# Altium schematic sheet Led_7seg.SchDoc
size A4; Author: Đỗ Ngọc Quý; Organization: Altium Limited; Address1: L3, 12a Rodborough Rd; Address2: Frenchs Forest; Address3: NSW; Address4: Australia 2086; DocumentNumber: 2; SheetNumber: 2; SheetTotal: 2
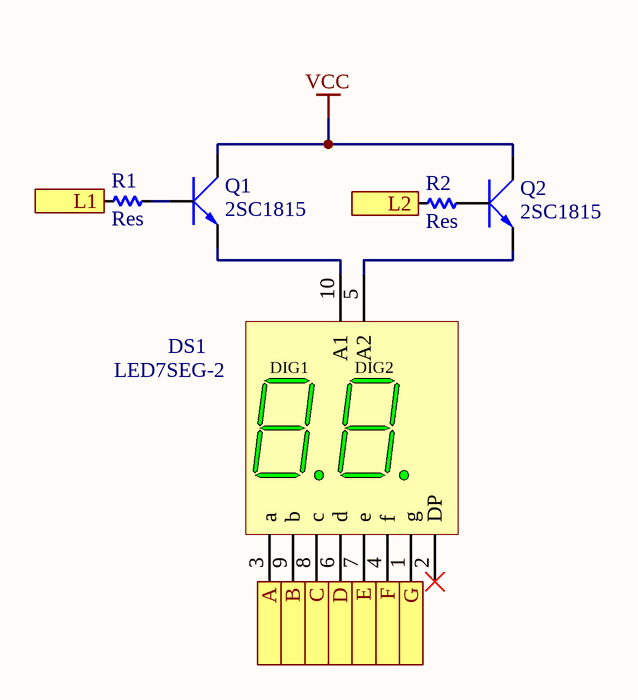
[diagram p0: Led_7seg.SchDoc]

## Parts
DS1  LED7SEG-2  [LED7SEG-2-0.36]
Q1  2SC1815  [SOT23-321]
Q2  2SC1815  [SOT23-321]
R1  Res  [RES-SMD-0101]
R2  Res  [RES-SMD-0101]

## Ports
A (in), B (in), C (in), D (in), E (in), F (in), G (in), L1 (in), L2 (in)

## Nets
VCC: Q1.2(C) Q2.2(C)
A: DS1.3(a) ; port A
B: DS1.9(b) ; port B
C: DS1.8(c) ; port C
D: DS1.6(d) ; port D
E: DS1.7(e) ; port E
F: DS1.4(f) ; port F
G: DS1.1(g) ; port G
L1: R1.1 ; port L1
L2: R2.1 ; port L2
NetDS1_5: DS1.5(A2) Q2.1(E)
NetDS1_10: DS1.10(A1) Q1.1(E)
NetQ1_3: Q1.3(B) R1.2
NetQ2_3: Q2.3(B) R2.2

Not connected (* = marked no-connect by the designer): DS1 2(DP)*

## Notes on the sheet
- Title
- Size:
- Date:
- A4
- Number:
- Time:
- Revision:
- Sheet
- of
- Author:
- File:
- (in symbol LED7SEG-2) DIG1; DIG2

## Library data of the parts
DS1 = LED7SEG-2: 9.2 mm Green 7-Segment Display: 2-Digit, RH DP; Published: 26-May-2004; LatestRevisionDate: 11-Oct-2004; LatestRevisionNote: Display outline superimposed on PCB Footprint.; DatasheetVersion: 14-Mar-2003; PackageVersion: 14-Mar-2003; PackageReference: HDSM-577; Publisher: Altium Limited; PackageDescription: LED, 7-Segment Display, 9.2 mm, Dual Digit; 10 Leads; Row Space 10.7 mm; Pitch 2.54 mm; ComponentLink1Description: Manufacturer Link; ComponentLink1URL: http://www.avagotech.com/
Q1 Q2 = 2SC1815: NPN 600mW, ECB; Value: C1815
R1 R2 = Res-SMD: Resistor; Manufacturer: Generic Components; Class: Passive; Published: 08/06/2000; Publisher: Altium Hobart Technology Centre